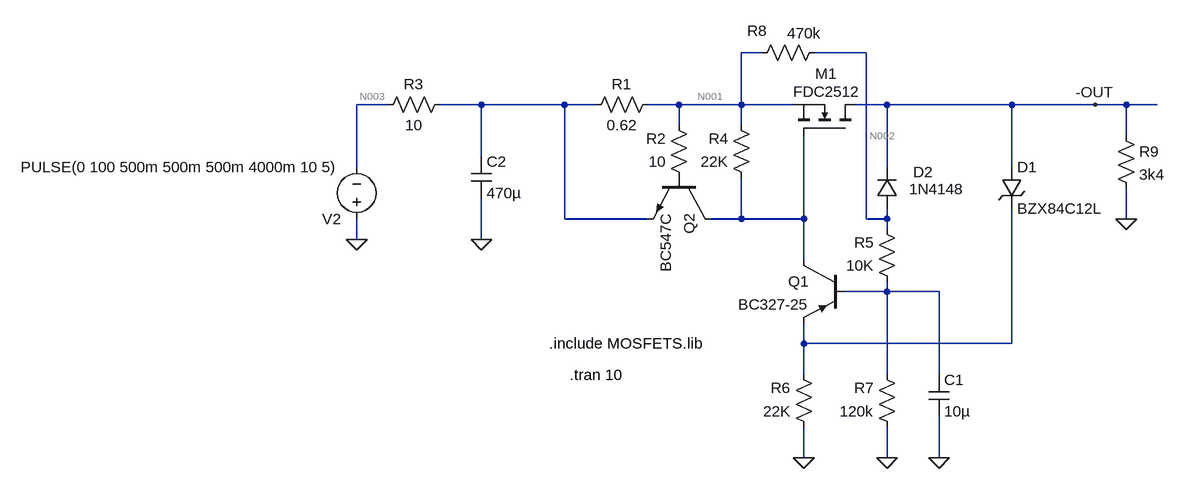
[diagram p0: schematic HV_Reg_Negative.asc]
HV_Reg_Negative.asc, the LTspice schematic file:
Version 4
SHEET 1 968 680
WIRE -208 -368 -240 -368
WIRE -48 -368 -128 -368
WIRE -784 -288 -832 -288
WIRE -640 -288 -704 -288
WIRE -512 -288 -640 -288
WIRE -464 -288 -512 -288
WIRE -336 -288 -384 -288
WIRE -240 -288 -240 -368
WIRE -240 -288 -336 -288
WIRE -160 -288 -240 -288
WIRE -16 -288 -64 -288
WIRE 176 -288 -16 -288
WIRE 304 -288 176 -288
WIRE 352 -288 304 -288
WIRE 400 -288 352 -288
WIRE -336 -256 -336 -288
WIRE -240 -256 -240 -288
WIRE 352 -240 352 -288
WIRE -640 -208 -640 -288
WIRE -832 -192 -832 -288
WIRE -16 -192 -16 -288
WIRE 176 -192 176 -288
WIRE -512 -112 -512 -288
WIRE -384 -112 -512 -112
WIRE -240 -112 -240 -176
WIRE -240 -112 -288 -112
WIRE -144 -112 -144 -240
WIRE -144 -112 -240 -112
WIRE -48 -112 -48 -368
WIRE -16 -112 -16 -128
WIRE -16 -112 -48 -112
WIRE 352 -112 352 -160
WIRE -16 -96 -16 -112
WIRE -832 -80 -832 -112
WIRE -640 -80 -640 -144
WIRE -144 -48 -144 -112
WIRE -16 0 -16 -16
WIRE -16 0 -80 0
WIRE 64 0 -16 0
WIRE -144 80 -144 48
WIRE 176 80 176 -128
WIRE 176 80 -144 80
WIRE -144 128 -144 80
WIRE -16 128 -16 0
WIRE 64 128 64 0
WIRE -144 256 -144 208
WIRE -16 256 -16 208
WIRE 64 256 64 192
FLAG -144 256 0
FLAG -16 256 0
FLAG 304 -288 -OUT
FLAG 64 256 0
FLAG 352 -112 0
FLAG -832 -80 0
FLAG -640 -80 0
SYMBOL pnp -80 -48 M0
SYMATTR InstName Q1
SYMATTR Value BC327-25
SYMBOL nmos -64 -240 M270
WINDOW 0 96 29 VRight 2
WINDOW 3 68 -7 VRight 2
SYMATTR InstName M1
SYMATTR Value FDC2512
SYMBOL npn -288 -176 R90
SYMATTR InstName Q2
SYMATTR Value BC547C
SYMBOL zener 160 -192 R0
SYMATTR InstName D1
SYMATTR Value BZX84C12L
SYMATTR Description Diode
SYMATTR Type diode
SYMBOL diode 0 -128 R180
WINDOW 0 -55 56 Left 2
WINDOW 3 -103 30 Left 2
SYMATTR InstName D2
SYMATTR Value 1N4148
SYMBOL res -368 -304 R90
WINDOW 0 0 56 VBottom 2
WINDOW 3 32 56 VTop 2
SYMATTR InstName R1
SYMATTR Value 0.62
SYMBOL res -320 -160 R180
WINDOW 0 36 76 Left 2
WINDOW 3 36 40 Left 2
SYMATTR InstName R2
SYMATTR Value 10
SYMBOL res -224 -160 R180
WINDOW 0 36 76 Left 2
WINDOW 3 36 40 Left 2
SYMATTR InstName R4
SYMATTR Value 22K
SYMBOL res 0 0 R180
WINDOW 0 36 76 Left 2
WINDOW 3 36 40 Left 2
SYMATTR InstName R5
SYMATTR Value 10K
SYMBOL res -128 224 R180
WINDOW 0 36 76 Left 2
WINDOW 3 36 40 Left 2
SYMATTR InstName R6
SYMATTR Value 22K
SYMBOL res 0 224 R180
WINDOW 0 36 76 Left 2
WINDOW 3 36 40 Left 2
SYMATTR InstName R7
SYMATTR Value 120k
SYMBOL cap 48 128 R0
SYMATTR InstName C1
SYMATTR Value 10µ
SYMBOL res -224 -352 R270
WINDOW 0 34 8 VTop 2
WINDOW 3 62 81 VBottom 2
SYMATTR InstName R8
SYMATTR Value 470k
SYMBOL res 336 -256 R0
SYMATTR InstName R9
SYMATTR Value 3k4
SYMBOL res -688 -304 R90
WINDOW 0 0 56 VBottom 2
WINDOW 3 32 56 VTop 2
SYMATTR InstName R3
SYMATTR Value 10
SYMBOL cap -656 -208 R0
SYMATTR InstName C2
SYMATTR Value 470µ
SYMBOL voltage -832 -96 R180
WINDOW 123 0 0 Left 2
WINDOW 39 0 0 Left 2
SYMATTR InstName V2
SYMATTR Value PULSE(0 100 500m 500m 500m 4000m 10 5)
TEXT -536 80 Left 2 !.include MOSFETS.lib
TEXT -504 128 Left 2 !.tran 10

The netlist it stands for:
* HV_Reg_Negative.asc
Q1 N005 N006 N007 0 BC327-25
M1 -OUT N005 N001 N001 FDC2512
Q2 N005 P001 N004 0 BC547C
D1 -OUT N007 BZX84C12L
D2 N002 -OUT 1N4148
R1 N001 N004 0.62
R2 P001 N001 10
R4 N005 N001 22K
R5 N006 N002 10K
R6 0 N007 22K
R7 0 N006 120k
C1 N006 0 10µ
R8 N001 N002 470k
R9 -OUT 0 3k4
R3 N004 N003 10
C2 N004 0 470µ
V2 0 N003 PULSE(0 100 500m 500m 500m 4000m 10 5)
.model D D
.lib standard.dio
.model NPN NPN
.model PNP PNP
.lib standard.bjt
.model NMOS NMOS
.model PMOS PMOS
.lib standard.mos
.include MOSFETS.lib
.tran 10
.backanno
.end

* Results of the author's LTspice run, read from the files saved beside the schematic
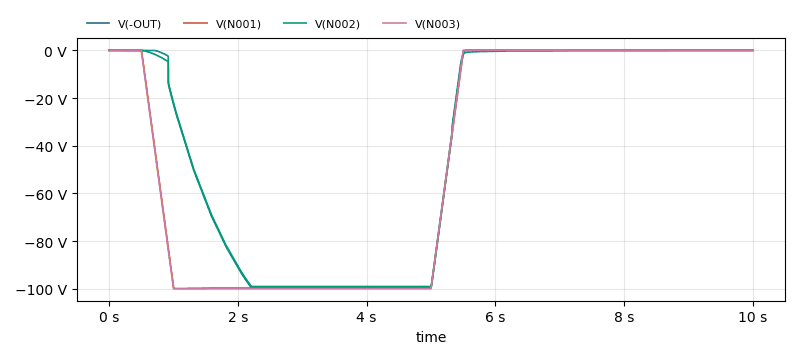
[diagram p1: Transient Analysis of HV_Reg_Negative.asc, plotted from the saved traces]
* Transient Analysis, 1 run:
*   V(-OUT): min -99.63 V, max 0 V, average -38.57 V, rms 59.58 V, last 0 V
*   V(N001): min -99.9 V, max 0 V, average -44.86 V, rms 65.62 V, last 0 V
*   V(N002): min -99.04 V, max 0 V, average -38.45 V, rms 59.21 V, last -5.742 mV
*   V(N003): min -100 V, max 0 V, average -45 V, rms 65.83 V, last 0 V